# Altium schematic sheet stm32.SchDoc
size A3; SheetNumber: 2; SheetTotal: 6
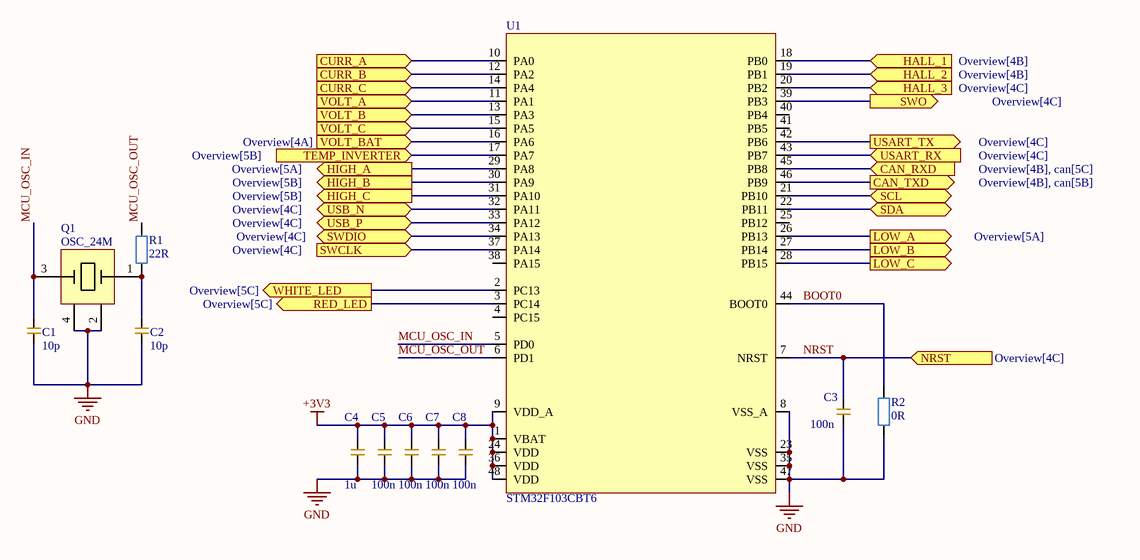
[diagram p0: stm32.SchDoc]

## Parts
C1  10p  [CAP_0603]
C2  10p  [CAP_0603]
C3  100n  [CAP_0603]
C4  1u  [CAP_0603]
C5  100n  [CAP_0603]
C6  100n  [CAP_0603]
C7  100n  [CAP_0603]
C8  100n  [CAP_0603]
Q1  OSC_24M  [OSC_24M]
R1  22R  [RES_0603]
R2  0R  [RES_0603]
U1  STM32F103CBT6  [STM32F103CBT6]

## Ports
CAN_RXD (in, see Overview[4B], can[5C]), CAN_TXD (out, see Overview[4B], can[5B]), CURR_A (in, see Overview[5B]), CURR_B (in, see Overview[5B]), CURR_C (in, see Overview[5B]), HALL_1 (in, see Overview[4B]), HALL_2 (in, see Overview[4B]), HALL_3 (in, see Overview[4C]), HIGH_A (out, see Overview[5A]), HIGH_B (out, see Overview[5B]), HIGH_C (out, see Overview[5B]), LOW_A (out, see Overview[5A]), LOW_B (out, see Overview[5B]), LOW_C (out, see Overview[5B]), NRST (in, see Overview[4C]), RED_LED (out, see Overview[5C]), SCL (bidir), SDA (bidir), SWCLK (in, see Overview[4C]), SWDIO (bidir, see Overview[4C]), SWO (out, see Overview[4C]), TEMP_INVERTER (in, see Overview[5B]), USART_RX (in, see Overview[4C]), USART_TX (out, see Overview[4C]), USB_N (bidir, see Overview[4C]), USB_P (bidir, see Overview[4C]), VOLT_A (in, see Overview[5B]), VOLT_B (in, see Overview[5B]), VOLT_BAT (in, see Overview[4A]), VOLT_C (in, see Overview[5B]), WHITE_LED (out, see Overview[5C])

## Nets
+3V3: C4.2 C5.2 C6.2 C7.2 C8.2 U1.1(VBAT) U1.9(VDD_A) U1.24(VDD) U1.36(VDD) U1.48(VDD)
GND: C1.1 C2.1 C3.1 C4.1 C5.1 C6.1 C7.1 C8.1 Q1.2 Q1.4 R2.1 U1.8(VSS_A) U1.23(VSS) U1.35(VSS) U1.47(VSS)
BOOT0: R2.2 U1.44(BOOT0)
CAN_RXD: U1.45(PB8) ; port CAN_RXD
CAN_TXD: U1.46(PB9) ; port CAN_TXD
CURR_A: U1.10(PA0) ; port CURR_A
CURR_B: U1.12(PA2) ; port CURR_B
CURR_C: U1.14(PA4) ; port CURR_C
HALL_1: U1.18(PB0) ; port HALL_1
HALL_2: U1.19(PB1) ; port HALL_2
HALL_3: U1.20(PB2) ; port HALL_3
HIGH_A: U1.29(PA8) ; port HIGH_A
HIGH_B: U1.30(PA9) ; port HIGH_B
HIGH_C: U1.31(PA10) ; port HIGH_C
LOW_A: U1.26(PB13) ; port LOW_A
LOW_B: U1.27(PB14) ; port LOW_B
LOW_C: U1.28(PB15) ; port LOW_C
MCU_OSC_IN: C1.2 Q1.3 U1.5(PD0)
MCU_OSC_OUT: R1.2 U1.6(PD1)
NRST: C3.2 U1.7(NRST) ; port NRST
RED_LED: U1.3(PC14) ; port RED_LED
SCL: U1.21(PB10) ; port SCL
SDA: U1.22(PB11) ; port SDA
SWCLK: U1.37(PA14) ; port SWCLK
SWDIO: U1.34(PA13) ; port SWDIO
SWO: U1.39(PB3) ; port SWO
TEMP_INVERTER: U1.17(PA7) ; port TEMP_INVERTER
USART_RX: U1.43(PB7) ; port USART_RX
USART_TX: U1.42(PB6) ; port USART_TX
USB_N: U1.32(PA11) ; port USB_N
USB_P: U1.33(PA12) ; port USB_P
VOLT_A: U1.11(PA1) ; port VOLT_A
VOLT_B: U1.13(PA3) ; port VOLT_B
VOLT_BAT: U1.16(PA6) ; port VOLT_BAT
VOLT_C: U1.15(PA5) ; port VOLT_C
WHITE_LED: U1.2(PC13) ; port WHITE_LED
NetC2_2: C2.2 Q1.1 R1.1

Not connected (* = marked no-connect by the designer): U1 4(PC15) 25(PB12) 38(PA15) 40(PB4) 41(PB5)

## Library data of the parts
C1-C8 = CAP_0603: Multilayer Ceramic Capacitors MLCC - SMD/SMT ROHS; Mfr.: *; Voltage Rating: *; Package: 0603; LCSC: *; Mfr. Part: *
Q1 = OSC_24M: Crystal 24Mhz; Manufacturer Part: X322524MOB4SI; LCSC: C70590; ComponentLink1Description: Datasheet; ComponentLink1URL: https://www.lcsc.com/datasheet/lcsc_datasheet_2403291504_YXC-Crystal-Oscillators-X322524MOB4SI_C70590.pdf
R1 R2 = RES_0603: 100mW Thick Film Resistors; Voltage Rating: *; Mfr. Part: *; Package: 0603; LCSC: *; Mfr.: *
U1 = STM32F103CBT6: Mainstream enhanced ARM Cortex-M3 MCU, featuring 128 KB Flash, 72 MHz CPU, motor control, USB, and CAN.; Mfr.: STMicroelectronics; Mfr. Part: STM32F103CBT6; LCSC: C8304